# Altium schematic sheet MCU.SchDoc
size A4
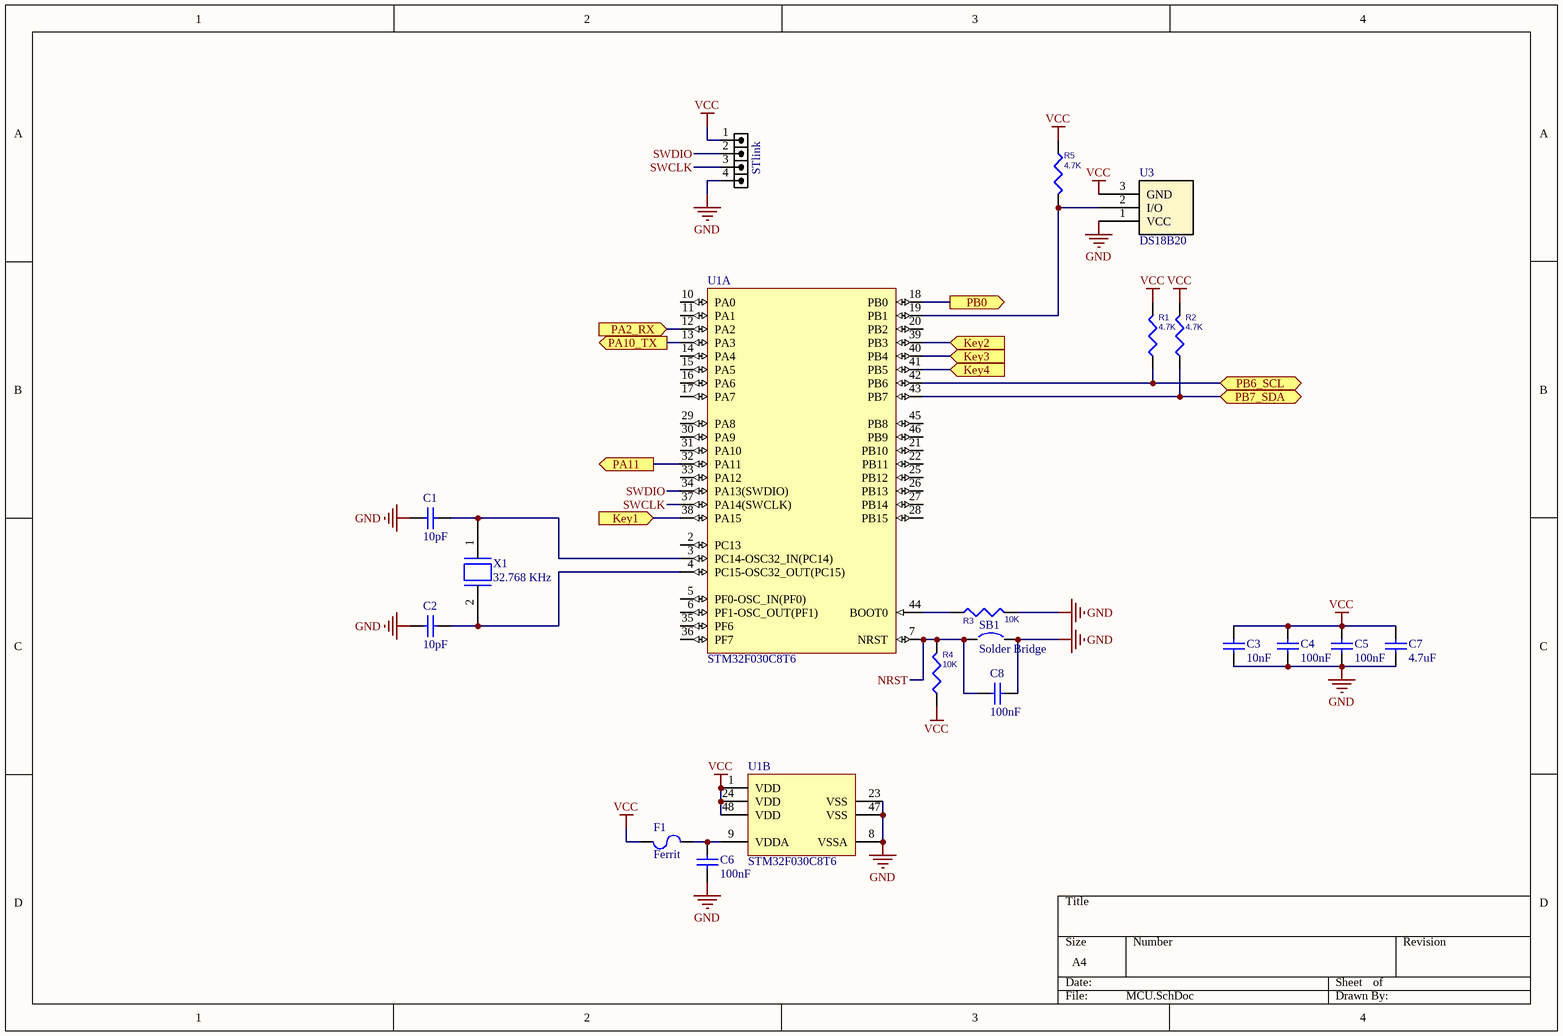
[diagram p0: MCU.SchDoc]

## Parts
C1  10pF  [0603C]
C2  10pF  [0603C]
C3  10nF  [0603C]
C4  100nF  [0603C]
C5  100nF  [0603C]
C6  100nF  [0603C]
C7  4.7uF  [0603C]
C8  100nF  [0603C]
F1  Ferrit  [0805F]
R1  4.7K  [0603R]
R2  4.7K  [0603R]
R3  10K  [0603R]
R4  10K  [0603R]
R5  4.7K  [0603R]
SB1  Solder Bridge  [Solder Bridge]
STlink  HDR1X4  [HDRR_M_1X4]  (value not drawn)
U1  STM32F030C8T6  [LQFP-48 7x7MM P0.5MM]  (parts A,B of 2)
U3  DS18B20  [TO-92]
X1  32.768 KHz  [32.768 - Right]

## Ports
Key1 (in), Key2 (in), Key3 (in), Key4 (in), PA2_RX (in), PA10_TX (out), PA11 (out), PB0 (out), PB6_SCL (bidir), PB7_SDA (bidir)

## Nets
GND: C1.1 C2.1 C3.1 C4.1 C5.1 C6.1 C7.1 C8.2 R3.2 SB1.2 STlink.4 U1.8(VSSA) U1.23(VSS) U1.47(VSS) U3.1(VCC)
VCC: C3.2 C4.2 C5.2 C7.2 F1.1 R1.2 R2.2 R4.1 R5.2 STlink.1 U1.1(VDD) U1.24(VDD) U1.48(VDD) U3.3(GND)
Key1: U1.38(PA15) ; port Key1
Key2: U1.39(PB3) ; port Key2
Key3: U1.40(PB4) ; port Key3
Key4: U1.41(PB5) ; port Key4
NRST: C8.1 R4.2 SB1.1 U1.7(NRST)
PA2_RX: U1.12(PA2) ; port PA2_RX
PA10_TX: U1.13(PA3) ; port PA10_TX
PA11: U1.32(PA11) ; port PA11
PB0: U1.18(PB0) ; port PB0
PB6_SCL: R1.1 U1.42(PB6) ; port PB6_SCL
PB7_SDA: R2.1 U1.43(PB7) ; port PB7_SDA
SWCLK: STlink.3 U1.37(PA14(SWCLK))
SWDIO: STlink.2 U1.34(PA13(SWDIO))
NetC1_2: C1.2 U1.3(PC14-OSC32_IN(PC14)) X1.1
NetC2_2: C2.2 U1.4(PC15-OSC32_OUT(PC15)) X1.2
NetC6_2: C6.2 F1.2 U1.9(VDDA)
NetR3_1: R3.1 U1.44(BOOT0)
NetR5_1: R5.1 U1.19(PB1) U3.2(I/O)

Not connected (* = marked no-connect by the designer): U1 2(PC13) 5(PF0-OSC_IN(PF0)) 6(PF1-OSC_OUT(PF1)) 10(PA0) 11(PA1) 14(PA4) 15(PA5) 16(PA6) 17(PA7) 20(PB2) 21(PB10) 22(PB11) 25(PB12) 26(PB13) 27(PB14) 28(PB15) 29(PA8) 30(PA9) 31(PA10) 33(PA12) 35(PF6) 36(PF7) 45(PB8) 46(PB9)

## Library data of the parts
C1-C8 = Cap: Capacitor
  C1 C2: Value: 10pF
  C3: Value: 10nF
  C4-C6 C8: Value: 100nF
  C7: Value: 4.7uF
F1 = Fuse SMD: Ferrit 0805; ComponentLink1Description: Digikey; ComponentLink1URL: https://www.digikey.com/short/pz37qm; CurrentRating: Ferrit
R1-R5 = R
  R1 R2 R5: Value: 4.7K
  R3 R4: Value: 10K
STlink = HDRR_M_1X4: CONN, HEADER, RightAngle, Male, pitch: 2.54mm, 4POS; VALUE: HDRM4
U1 = STM32F030C8T6: ARM Cortex-M0 32-bit MCU, 64 KB Flash, 8 KB Internal RAM, 39 I/Os, 48-pin LQFP, -40 to 85 degC, Tray; FLASH Size (Prog) (kB): 64; I/Os (High Current): 39; Internal RAM Size (kB): 8; Operating Frequency(F) (Processor speed) (MHz): 48; Supply Voltage(Vcc) min (V): 2.4; DatasheetVersion: Rev. 1; PackageVersion: Rev. 6, 06/2013; PackageReference: LQFP48; PackageDescription: 48-Pin Low Profile Quad Flat Package, 7 x 7 mm Body, 0.5 mm Pitch; Supplier 1: Digi-Key; Supplier Part Number 1: 497-14043-ND; Supplier 2: Newark; Supplier Part Number 2: 06X3647; Supplier 3: Mouser; Supplier Part Number 3: 511-STM32F030C8T6; Core: ARM Cortex-M0; Packing: Tray; Mounting Technology: Surface Mount; PartNumber: STM32F030C8T6; ComponentLink1Description: Manufacturer URL; ComponentLink1URL: http://www.st.com/web/en/home.html; ComponentLink2Description: Datasheet; ComponentLink2URL: http://www.st.com/st-web-ui/static/active/en/resource/technical/document/datasheet/DM00088500.pdf; ComponentLink3Description: Package Specification; ComponentLink3URL: http://www.st.com/st-web-ui/static/active/en/resource/technical/document/datasheet/DM00058181.pdf
X1 = XTAL: Frequency: 32.768 KHz